# EAGLE design circuit (EAGLE 9.5.2)
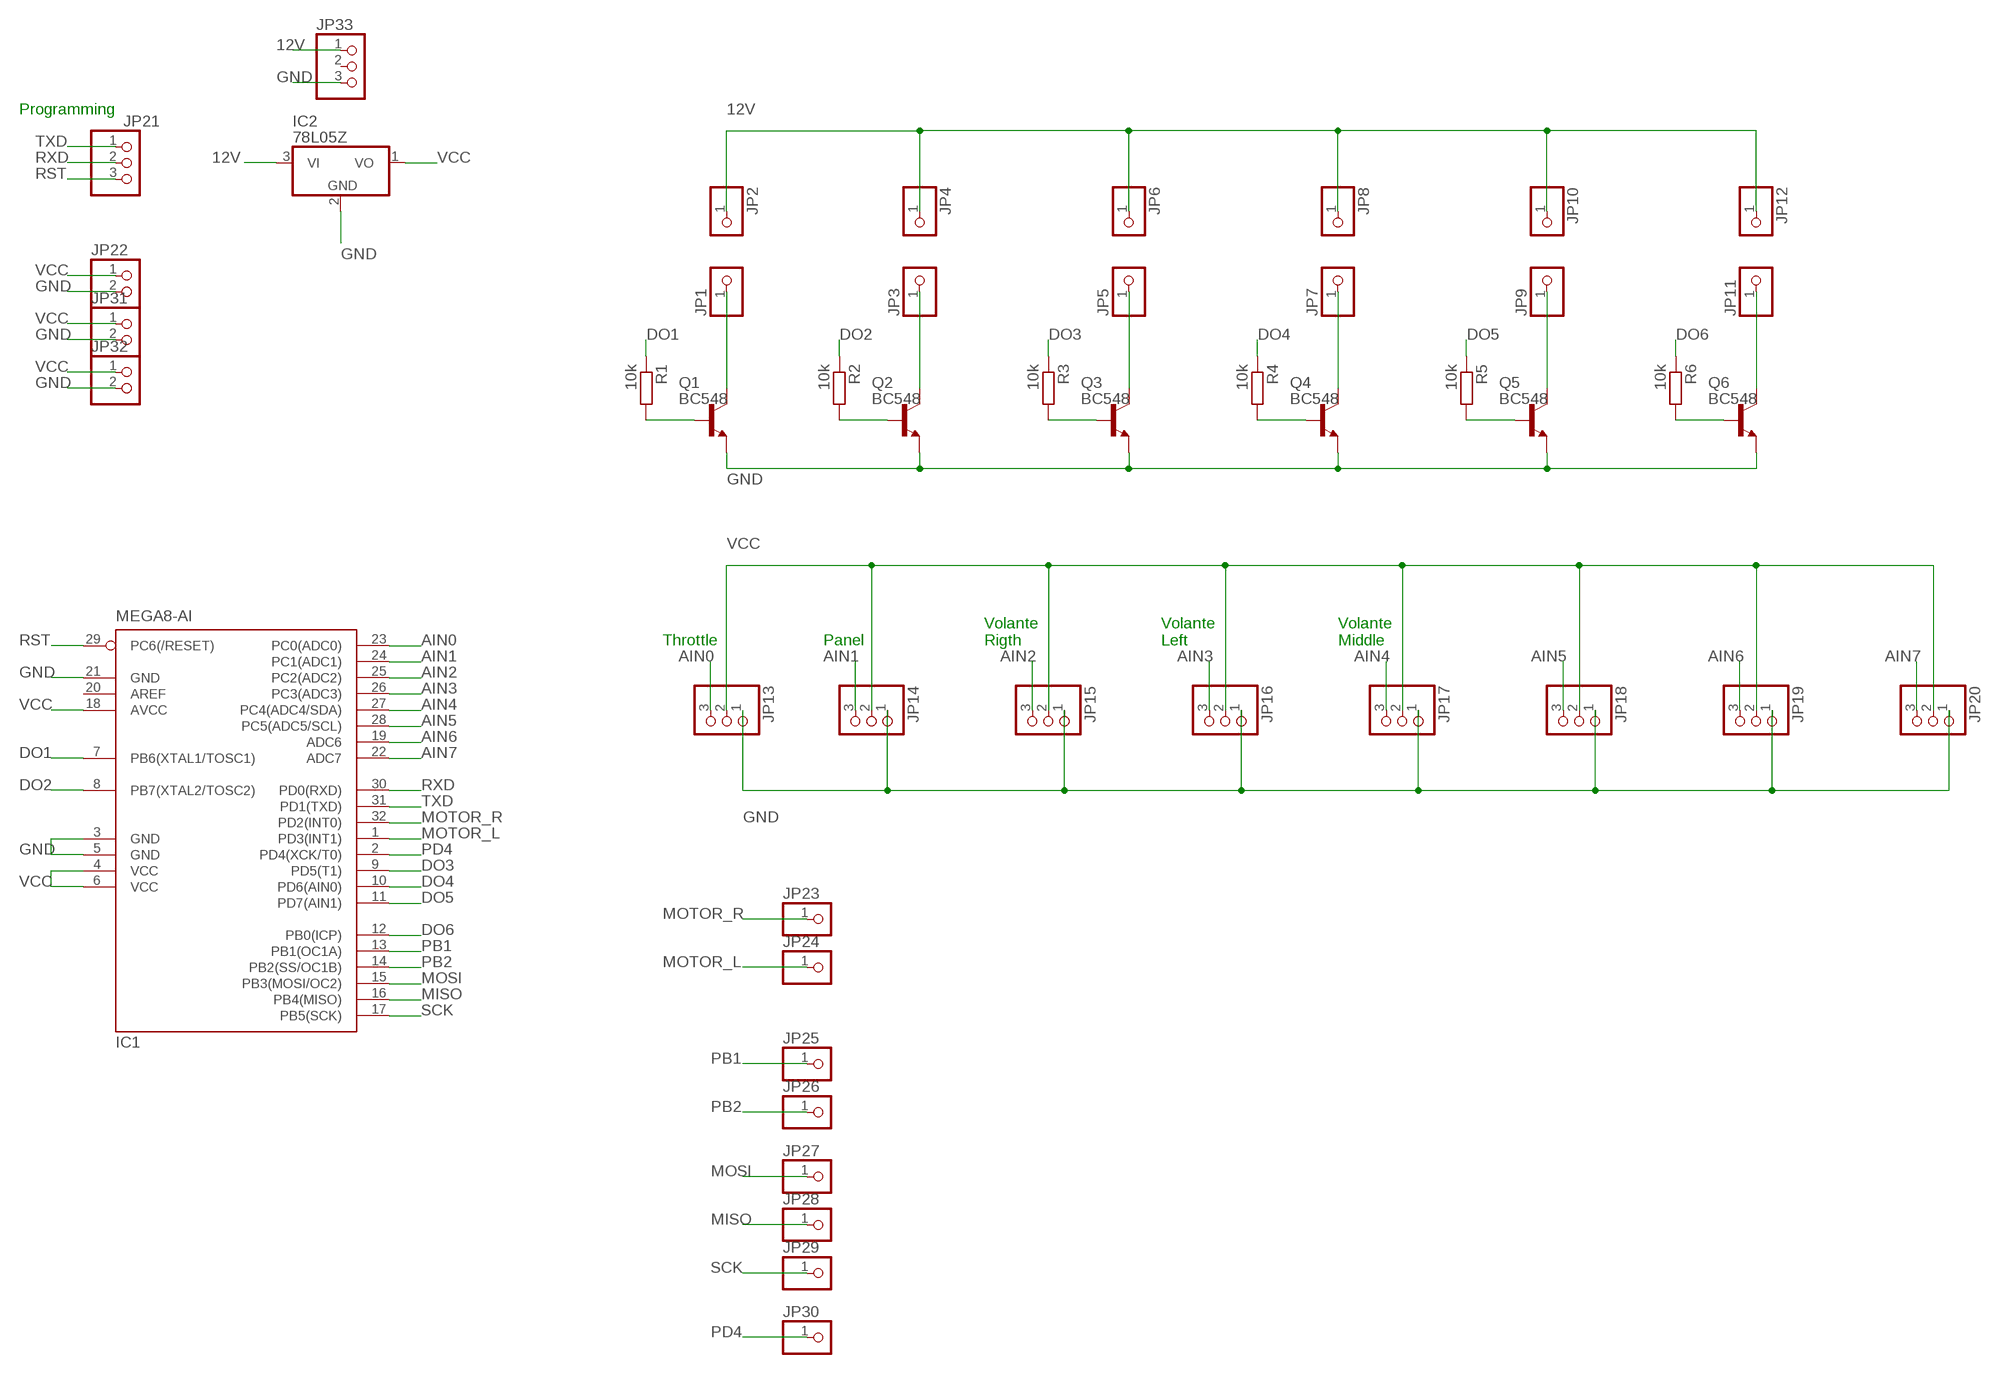
[diagram p0: schematic, sheet 1]

## Parts
IC1  MEGA8-AI  [TQFP32-08]
IC2  78L05Z  [TO92]
JP1  PINHD-1X1  [1X01]
JP2  PINHD-1X1  [1X01]
JP3  PINHD-1X1  [1X01]
JP4  PINHD-1X1  [1X01]
JP5  PINHD-1X1  [1X01]
JP6  PINHD-1X1  [1X01]
JP7  PINHD-1X1  [1X01]
JP8  PINHD-1X1  [1X01]
JP9  PINHD-1X1  [1X01]
JP10  PINHD-1X1  [1X01]
JP11  PINHD-1X1  [1X01]
JP12  PINHD-1X1  [1X01]
JP13  PINHD-1X3  [1X03]
JP14  PINHD-1X3  [1X03]
JP15  PINHD-1X3  [1X03]
JP16  PINHD-1X3  [1X03]
JP17  PINHD-1X3  [1X03]
JP18  PINHD-1X3  [1X03]
JP19  PINHD-1X3  [1X03]
JP20  PINHD-1X3  [1X03]
JP21  PINHD-1X3  [1X03]
JP22  PINHD-1X2  [1X02]
JP23  PINHD-1X1  [1X01]
JP24  PINHD-1X1  [1X01]
JP25  PINHD-1X1  [1X01]
JP26  PINHD-1X1  [1X01]
JP27  PINHD-1X1  [1X01]
JP28  PINHD-1X1  [1X01]
JP29  PINHD-1X1  [1X01]
JP30  PINHD-1X1  [1X01]
JP31  PINHD-1X2  [1X02]
JP32  PINHD-1X2  [1X02]
JP33  PINHD-1X3  [1X03]
Q1  BC548  [TO92-EBC]
Q2  BC548  [TO92-EBC]
Q3  BC548  [TO92-EBC]
Q4  BC548  [TO92-EBC]
Q5  BC548  [TO92-EBC]
Q6  BC548  [TO92-EBC]
R1  10k  R-EU_0207/10  [0207/10]
R2  10k  R-EU_0207/10  [0207/10]
R3  10k  R-EU_0207/10  [0207/10]
R4  10k  R-EU_0207/10  [0207/10]
R5  10k  R-EU_0207/10  [0207/10]
R6  10k  R-EU_0207/10  [0207/10]

## Nets
12V: IC2.3(VI) JP2.1 JP4.1 JP6.1 JP8.1 JP10.1 JP12.1 JP33.1
AIN0: IC1.23(PC0(ADC0)) JP13.3
AIN1: IC1.24(PC1(ADC1)) JP14.3
AIN2: IC1.25(PC2(ADC2)) JP15.3
AIN3: IC1.26(PC3(ADC3)) JP16.3
AIN4: IC1.27(PC4(ADC4/SDA)) JP17.3
AIN5: IC1.28(PC5(ADC5/SCL)) JP18.3
AIN6: IC1.19(ADC6) JP19.3
AIN7: IC1.22(ADC7) JP20.3
DO1: IC1.7(PB6(XTAL1/TOSC1)) R1.1
DO2: IC1.8(PB7(XTAL2/TOSC2)) R2.1
DO3: IC1.9(PD5(T1)) R3.1
DO4: IC1.10(PD6(AIN0)) R4.1
DO5: IC1.11(PD7(AIN1)) R5.1
DO6: IC1.12(PB0(ICP)) R6.1
GND: IC1.3(GND) IC1.5(GND) IC1.21(GND) IC2.2(GND) JP13.1 JP14.1 JP15.1 JP16.1 JP17.1 JP18.1 JP19.1 JP20.1 JP22.2 JP31.2 JP32.2 JP33.3 Q1.E Q2.E Q3.E Q4.E Q5.E Q6.E
MISO: IC1.16(PB4(MISO)) JP28.1
MOSI: IC1.15(PB3(MOSI/OC2)) JP27.1
MOTOR_L: IC1.1(PD3(INT1)) JP24.1
MOTOR_R: IC1.32(PD2(INT0)) JP23.1
N$1: Q1.B R1.2
N$2: Q2.B R2.2
N$3: Q3.B R3.2
N$4: Q4.B R4.2
N$5: Q5.B R5.2
N$6: Q6.B R6.2
OUT1: JP1.1 Q1.C
OUT2: JP3.1 Q2.C
OUT3: JP5.1 Q3.C
OUT4: JP7.1 Q4.C
OUT5: JP9.1 Q5.C
OUT6: JP11.1 Q6.C
PB1: IC1.13(PB1(OC1A)) JP25.1
PB2: IC1.14(PB2(SS/OC1B)) JP26.1
PD4: IC1.2(PD4(XCK/T0)) JP30.1
RST: IC1.29(PC6(/RESET)) JP21.3
RXD: IC1.30(PD0(RXD)) JP21.2
SCK: IC1.17(PB5(SCK)) JP29.1
TXD: IC1.31(PD1(TXD)) JP21.1
VCC: IC1.4(VCC) IC1.6(VCC) IC1.18(AVCC) IC2.1(VO) JP13.2 JP14.2 JP15.2 JP16.2 JP17.2 JP18.2 JP19.2 JP20.2 JP22.1 JP31.1 JP32.1
Unconnected: IC1.20(AREF) JP33.2

## Notes on the sheet
- Programming
- Throttle | Panel
- Volante
  Rigth
- Volante
  Left
- Volante
  Middle

## Library data of the parts
IC1 = atmel:MEGA8: MICROCONTROLLER 8 Kbytes FLASH, 1 kbytes SRAM, 512 bytes EEPROM, USART, 6-channel 10 bit ADC, 2-channel 8 bit ADC Pin compatible with Atmega48, ATMega88, ATMega168 Source: avr.lbr; MPN: ATMEGA8-16AU; OC_FARNELL: 9171371; OC_NEWARK: 73M8863
IC2 = linear:78*: Positive VOLTAGE REGULATOR Source: http://cache.national.com/ds/LM/LM78L05.pdf http://www.fairchildsemi.com/ds/LM/LM7805.pdf
JP1-JP12 JP23-JP30 = pinhead:PINHD-1X1: PIN HEADER
JP13-JP21 JP33 = pinhead:PINHD-1X3: PIN HEADER
JP22 JP31 JP32 = pinhead:PINHD-1X2: PIN HEADER
Q1-Q6 = transistor-npn:BC548*: NPN Transistor
R1-R6 = rcl:R-EU_: RESISTOR, European symbol; SPICEPREFIX: R

## Board
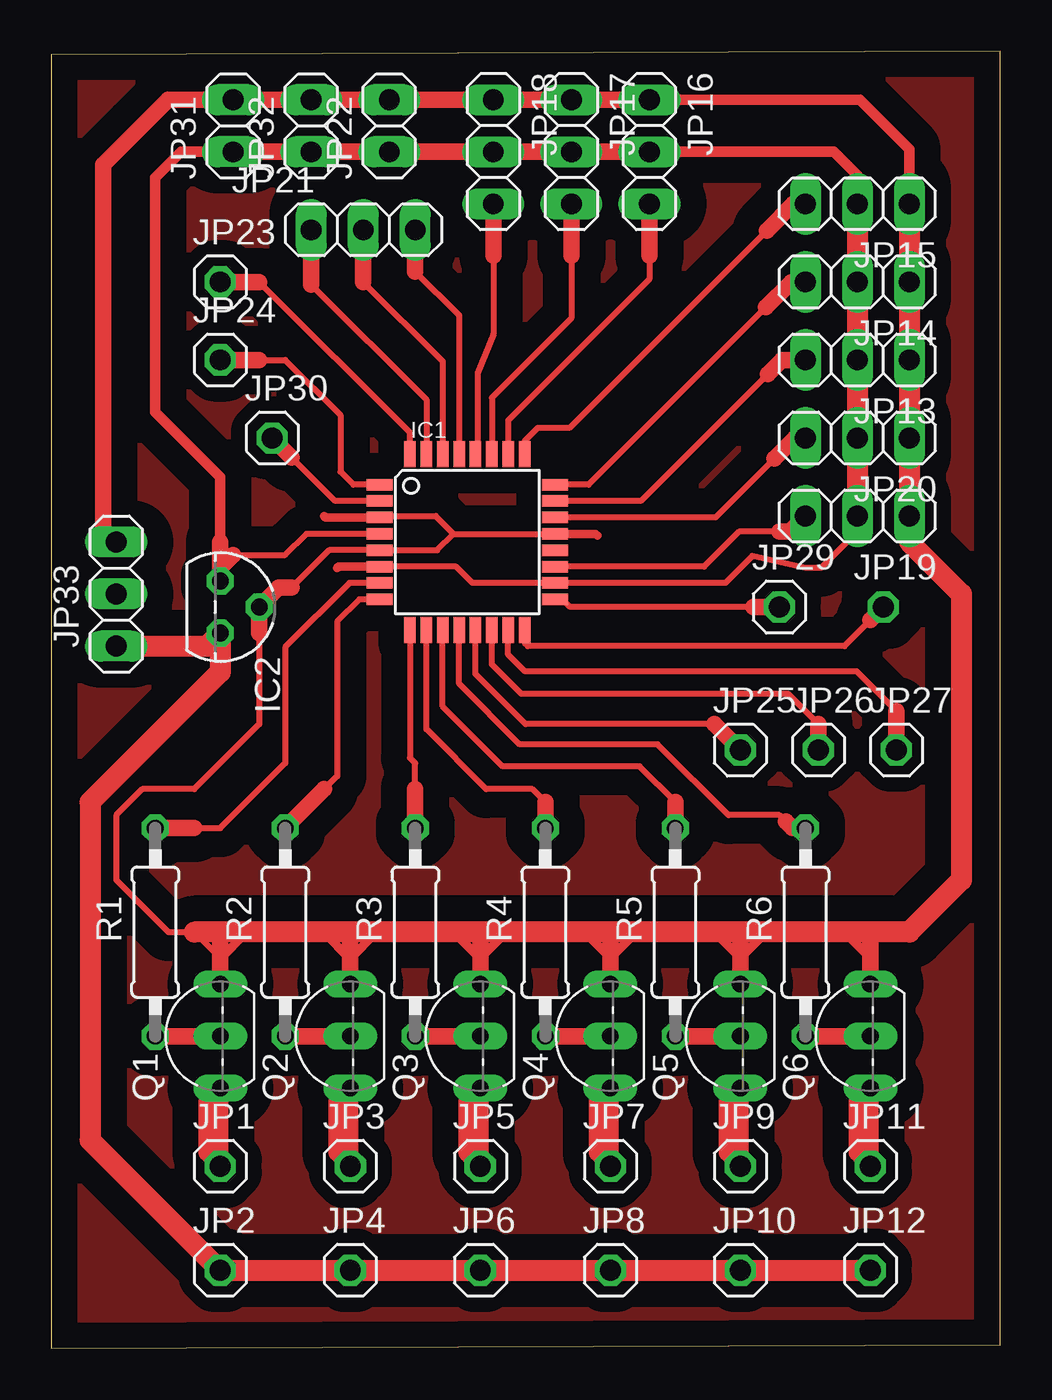
[diagram p1: board, top side]
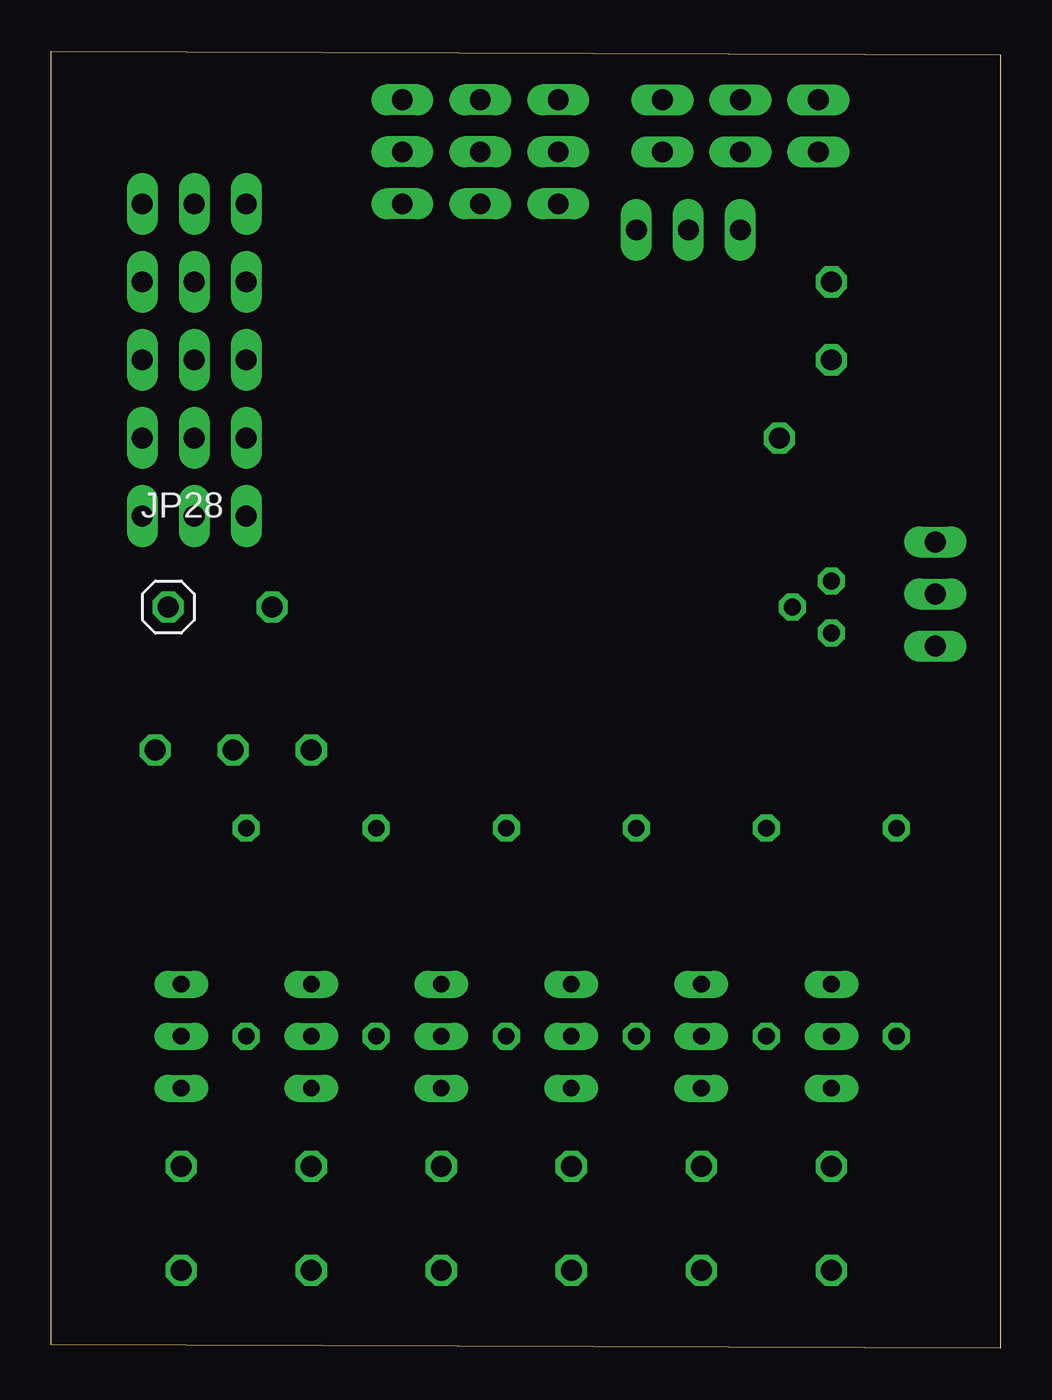
[diagram p2: board, bottom side, seen from below]

Size 46.35 x 63.34 mm. Coordinates in mm from the lower left corner, seen from the top.
Outline: 0,0 46.35,0.17 46.35,63.34 0,63.17 0,0
Copper layers (1*16): Top 0.035mm / dielectric 1.5mm / Bottom 0.035mm
Design rules "default": minimum track width 6mil, minimum drill 0.35mm, track to track 6mil, track to pad 6mil, pad to pad 6mil, via to via 6mil, smd to smd 6mil, copper to edge 40mil, drill to drill 6mil, minimum pad ring 10mil, minimum via ring 8mil, stop-mask expansion 4mil, vias tented up to drill 0mil, thermal gap 10mil

### Footprints (pad centres in the part's own frame; a part is rotated, then mirrored left to right if it is on the bottom)
TQFP32-08 = smd 1.27 x 0.559: 1 -4.293,2.8; 2 -4.293,2; 3 -4.293,1.2; 4 -4.293,0.4; 5 -4.293,-0.4; 6 -4.293,-1.2; 7 -4.293,-2; 8 -4.293,-2.8; 17 4.293,-2.8; 18 4.293,-2; 19 4.293,-1.2; 20 4.293,-0.4; 21 4.293,0.4; 22 4.293,1.2; 23 4.293,2; 24 4.293,2.8 | smd 0.559 x 1.27: 9 -2.8,-4.293; 10 -2,-4.293; 11 -1.2,-4.293; 12 -0.4,-4.293; 13 0.4,-4.293; 14 1.2,-4.293; 15 2,-4.293; 16 2.8,-4.293; 25 2.8,4.293; 26 2,4.293; 27 1.2,4.293; 28 0.4,4.293; 29 -0.4,4.293; 30 -1.2,4.293; 31 -2,4.293; 32 -2.8,4.293
TO92 = drill 0.813 octagon: 1 -1.27,0; 2 0,1.905; 3 1.27,0
1X01 = drill 1.016 octagon: 1 0,0
1X03 = drill 1.016 long: 1 -2.54,0; 2 0,0; 3 2.54,0
1X02 = drill 1.016 long: 1 -1.27,0; 2 1.27,0
TO92-EBC = drill 0.813 long: B 0,-1.27; C -2.54,-1.27; E 2.54,-1.27
0207/10 = drill 0.813 octagon: 1 -5.08,0; 2 5.08,0

### Placement (x,y rotation side)
IC1  20.32,39.37 0 top
IC2  8.26,36.2 270 top
JP1  8.26,8.89 0 top
JP2  8.26,3.81 0 top
JP3  14.61,8.89 0 top
JP4  14.61,3.81 0 top
JP5  20.95,8.89 0 top
JP6  20.95,3.81 0 top
JP7  27.3,8.89 0 top
JP8  27.3,3.81 0 top
JP9  33.66,8.89 0 top
JP10  33.66,3.81 0 top
JP11  40.01,8.89 0 top
JP12  40.01,3.81 0 top
JP13  39.37,48.26 180 top
JP14  39.37,52.07 180 top
JP15  39.37,55.88 180 top
JP16  29.21,58.42 270 top
JP17  25.4,58.42 270 top
JP18  21.59,58.42 270 top
JP19  39.37,40.64 180 top
JP20  39.37,44.45 180 top
JP21  15.24,54.61 0 top
JP22  16.51,59.69 90 top
JP23  8.26,52.07 0 top
JP24  8.26,48.26 0 top
JP25  33.66,29.21 0 top
JP26  37.47,29.21 0 top
JP27  41.27,29.21 0 top
JP28  40.64,36.2 0 bottom
JP29  35.56,36.2 0 top
JP30  10.79,44.45 0 top
JP31  8.89,59.69 90 top
JP32  12.7,59.69 90 top
JP33  3.17,36.83 90 top
Q1  6.99,15.24 90 top
Q2  13.34,15.24 90 top
Q3  19.68,15.24 90 top
Q4  26.04,15.24 90 top
Q5  32.38,15.24 90 top
Q6  38.73,15.24 90 top
R1  5.08,20.32 270 top
R2  11.43,20.32 270 top
R3  17.78,20.32 270 top
R4  24.13,20.32 270 top
R5  30.48,20.32 270 top
R6  36.83,20.32 270 top

### Tracks (layer width: path | path; a pad name or v marks a point on that pad's centre or on a via)
12V
  Top 1.016: JP12.1 JP10.1 JP8.1 JP6.1 JP4.1 JP2.1 1.91,10.16 1.91,26.67 8.26,33.02 IC2.3 7.62,34.29 3.94,34.29 JP33.1
AIN0
  Top 0.3: 34.99,47.56 28.8,41.37 IC1.23
  Top 0.813: JP13.3 35.69,48.26 34.99,47.56
AIN1
  Top 0.3: 34.9,50.83 26.24,42.17 IC1.24
  Top 0.813: JP14.3 36.14,52.07 34.9,50.83
AIN2
  Top 0.3: 34.95,54.58 25.3,44.93 23.75,44.93 23.12,44.3 IC1.25
  Top 0.813: JP15.3 36.25,55.88 34.95,54.58
AIN3
  Top 0.3: 29.21,53.34 29.21,52.2 22.32,45.31 IC1.26
  Top 0.813: JP16.3 29.21,53.34
AIN4
  Top 0.3: 25.4,53.34 25.4,50.29 21.52,46.41 IC1.27
  Top 0.813: JP17.3 25.4,53.34
AIN5
  Top 0.3: 21.59,53.34 21.59,49.53 20.83,47.62 20.83,43.77 IC1.28
  Top 0.813: JP18.3 21.59,53.34
AIN6
  Top 0.3: 35.56,39.88 33.59,39.88 31.88,38.17 IC1.19
  Top 0.813: JP19.3 36.07,39.88 35.56,39.88
AIN7
  Top 0.3: 35.31,43.43 32.44,40.57 IC1.22
  Top 0.813: JP20.3 36.32,44.45 35.31,43.43
DO1
  Top 0.3: IC1.7 14.56,37.37 11.43,34.24 11.43,28.57 8.26,25.4 6.99,25.4
  Top 0.813: R1.1 6.99,25.4
DO2
  Top 0.3: IC1.8 15.04,36.57 13.97,35.5 13.97,27.94 13.34,27.3
  Top 0.813: R2.1 13.34,27.3
DO3
  Top 0.3: IC1.9 17.52,28.84 17.78,28.57 17.78,27.3
  Top 0.813: R3.1 17.78,27.3
DO4
  Top 0.3: 24.13,26.67 23.5,27.3 21.25,27.3 18.32,30.23 IC1.10
  Top 0.813: R4.1 24.13,26.67
DO5
  Top 0.3: 30.48,26.67 28.74,28.41 22.05,28.41 19.12,31.34 IC1.11
  Top 0.813: R5.1 30.48,26.67
DO6
  Top 0.3: 35.88,25.72 35.56,26.04 33.08,26.04 29.62,29.49 22.88,29.49 19.92,32.45 IC1.12
  Top 0.813: R6.1 36.2,25.4 35.88,25.72
GND
  Top 0.3: 19.65,39.77 IC1.21 | 19.65,39.77 18.85,38.97 IC1.5 13.57,38.97 11.75,37.15 | IC1.3 16.1,40.64 18.78,40.64 19.65,39.77 | 10.16,34.92 10.16,30.48 6.99,27.3 4.45,27.3 3.17,26.04 3.17,22.86 5.71,20.32 6.99,20.32 8.26,19.05 8.26,19.02
  Top 0.406: Q1.E 8.26,19.02 9.55,20.32 13.31,20.32 14.61,19.02 | Q2.E 14.61,19.02 | 14.61,19.02 15.9,20.32 19.66,20.32 20.95,19.02 Q3.E 20.95,19.05 22.23,20.32 26.04,20.32 27.3,19.05 | 27.3,19.05 28.57,20.32 32.38,20.32 33.66,19.05 | Q4.E 27.3,19.05 | Q5.E 33.66,19.05 | 33.66,19.05 34.92,20.32 38.73,20.32 40.01,19.05 Q6.E | IC1.3 13.4,40.57 13.34,40.64 | IC1.21 26.59,39.77 26.67,39.69
  Top 0.508: JP16.1 39.5,60.96 41.91,58.55 JP15.1
  Top 0.813: JP16.1 JP17.1 JP18.1 JP22.2 JP32.2 JP31.2 5.71,60.96 2.54,57.78 2.54,40.01 JP33.3 | Q1.E 8.26,20.32 | Q2.E 14.61,20.32 | Q3.E 20.95,20.32 | Q4.E 27.3,20.32 | Q5.E 33.66,20.32 | Q6.E 40.01,20.32 | 11.75,37.15 11.11,37.15 IC2.2 10.16,34.92
  Top 1.016: JP15.1 JP14.1 JP13.1 JP20.1 JP19.1 41.91,39.37 44.45,36.83 44.45,22.86 41.91,20.32 40.01,20.32 33.66,20.32 27.3,20.32 20.95,20.32 14.61,20.32 8.26,20.32 6.99,20.32
MISO
  Top 0.3: 40.01,35.56 38.73,34.29 23.27,34.29 23.12,34.44 IC1.16
  Top 0.813: JP28.1 40.01,35.56
MOSI
  Top 0.3: 41.27,31.11 39.34,33.05 23.15,33.05 22.32,33.88 IC1.15
  Top 0.813: JP27.1 41.27,31.11
MOTOR_L
  Top 0.3: IC1.1 14.76,42.17 14.12,42.8 14.12,45.57 11.43,48.26 10.16,48.26
  Top 0.813: JP24.1 10.16,48.26
MOTOR_R
  Top 0.3: IC1.32 17.52,44.71 10.16,52.07
  Top 0.813: JP23.1 10.16,52.07
N$1
  Top 0.813: Q1.B R1.2
N$2
  Top 0.813: Q2.B R2.2
N$3
  Top 0.813: Q3.B R3.2
N$4
  Top 0.813: Q4.B R4.2
N$5
  Top 0.813: Q5.B R5.2
N$6
  Top 0.813: Q6.B R6.2
N$7
  pour Top (isolate 1.27): 0,63.5 46.35,63.5 46.35,0 0,0
OUT1
  Top 0.406: Q1.C 7.59,12.7 7.59,12.06
  Top 0.813: Q1.C JP1.1 7.59,9.55 7.59,12.06
OUT2
  Top 0.406: Q2.C 13.95,12.7 13.95,12.06
  Top 0.813: Q2.C JP3.1 13.95,9.55 13.95,12.06
OUT3
  Top 0.406: Q3.C 20.3,12.7 20.3,12.06
  Top 0.813: Q3.C JP5.1 20.3,9.55 20.3,12.06
OUT4
  Top 0.406: Q4.C 26.64,12.7 26.64,12.06
  Top 0.813: Q4.C JP7.1 26.64,9.55 26.64,12.06
OUT5
  Top 0.406: Q5.C 32.99,12.7 32.99,12.06
  Top 0.813: Q5.C JP9.1 32.99,9.55 32.99,12.06
OUT6
  Top 0.406: Q6.C 39.34,12.7 39.34,12.06
  Top 0.813: Q6.C JP11.1 39.34,9.55 39.34,12.06
PB1
  Top 0.3: 32.38,30.48 23.16,30.48 20.72,32.92 IC1.13
  Top 0.813: JP25.1 32.38,30.48
PB2
  Top 0.3: 37.47,30.48 35.99,31.96 22.96,31.96 21.52,33.4 IC1.14
  Top 0.813: JP26.1 37.47,30.48
PD4
  Top 0.3: IC1.2 13.88,41.37 11.75,43.5
  Top 0.813: JP30.1 11.75,43.5
RST
  Top 0.3: 17.78,52.58 19.92,50.44 IC1.29
  Top 0.813: JP21.3 17.78,52.58
RXD
  Top 0.3: 15.24,52.07 19.12,48.19 IC1.30
  Top 0.813: JP21.2 15.24,52.07
SCK
  Top 0.3: 34.29,36.2 25.34,36.2 24.97,36.57 IC1.17
  Top 0.813: JP29.1 34.29,36.2
TXD
  Top 0.3: 12.7,51.94 18.32,46.32 IC1.31
  Top 0.813: JP21.1 12.7,51.94
VCC
  Top 0.3: JP19.2 39.37,39.88 37.59,38.1 36.83,38.1 34.24,38.69 32.92,37.37 IC1.18 20.57,37.37 19.77,38.17 IC1.6 | 8.89,38.73 11.43,38.73 12.46,39.77 IC1.4
  Top 0.406: IC1.6 14.04,38.17 13.97,38.1
  Top 0.508: JP16.2 38.23,58.42 39.37,57.28 JP15.2 | JP31.1 6.35,58.42 5.08,57.15 5.08,45.72 8.26,42.55 8.26,39.37
  Top 0.813: JP16.2 JP17.2 JP18.2 JP22.1 JP32.1 JP31.1 | 8.26,39.37 IC2.1 8.26,38.1 8.89,38.73
  Top 1.016: JP19.2 JP20.2 JP13.2 JP14.2 JP15.2